# EAGLE design hw1_atmega328_veroboard (EAGLE 5.11)
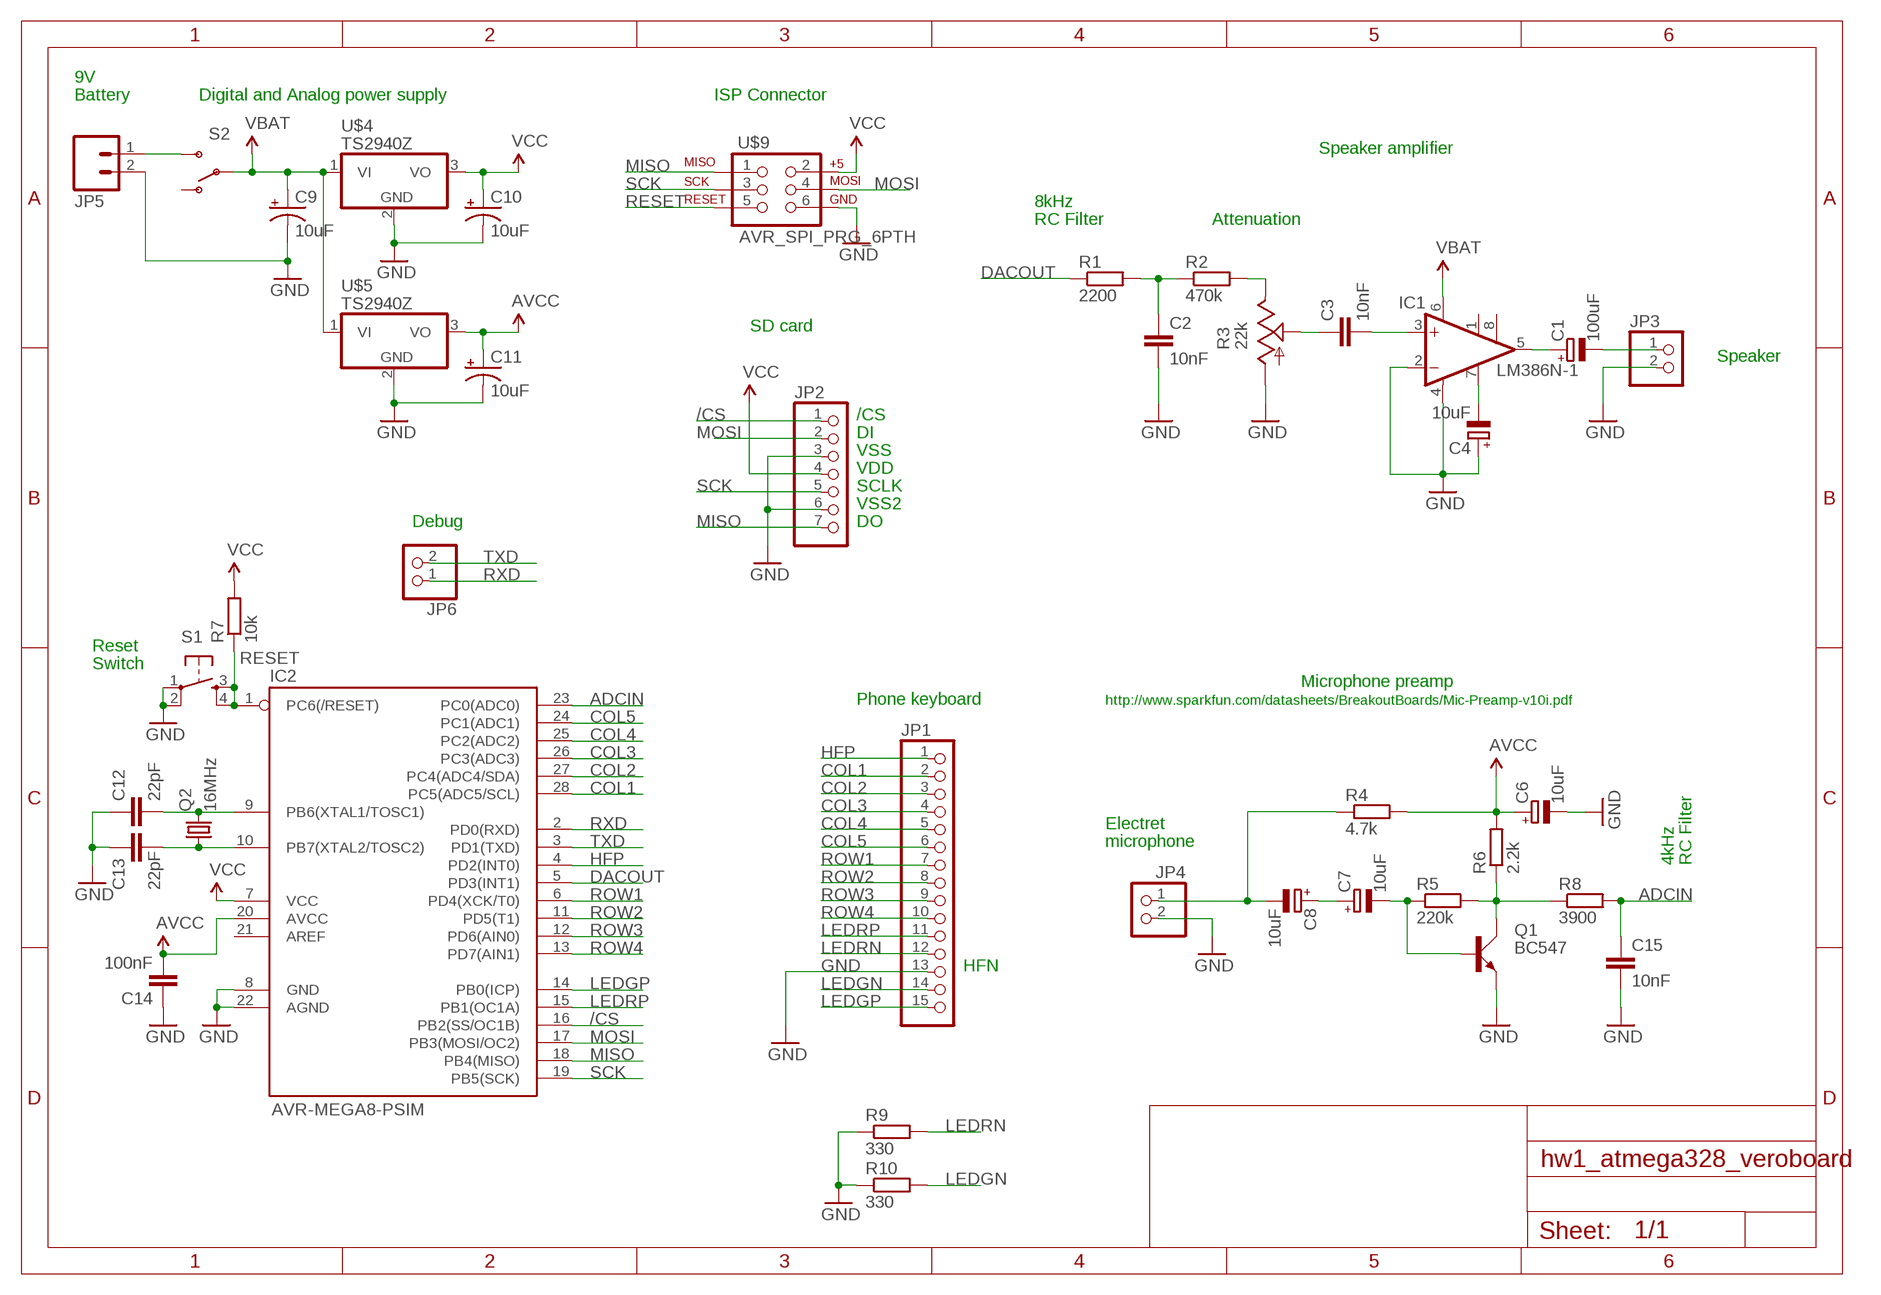
[diagram p0: schematic, sheet 1]

## Parts
C1  100uF  CPOL-EUE2-4  [E2-4]
C2  10nF  C-EU050-025X075  [C050-025X075]
C3  10nF  C-EU050-025X075  [C050-025X075]
C4  10uF  CPOL-EUE2-4  [E2-4]
C6  10uF  CPOL-EUE2,5-6E  [E2,5-6E]
C7  10uF  CPOL-EUE2,5-6E  [E2,5-6E]
C8  10uF  CPOL-EUE2,5-6E  [E2,5-6E]
C9  10uF  CPOL-USE2,5-6E  [E2,5-6E]
C10  10uF  CPOL-USE2,5-6E  [E2,5-6E]
C11  10uF  CPOL-USE2,5-6E  [E2,5-6E]
C12  22pF  C-EU025-025X050  [C025-025X050]
C13  22pF  C-EU025-025X050  [C025-025X050]
C14  100nF  C-EU025-025X050  [C025-025X050]
C15  10nF  C-EU025-024X044  [C025-024X044]
IC1  LM386N-1  [DIL08]
IC2  AVR-MEGA8-PSIM  [DIL28-3-SIMON]
JP1  PINHD-1X15  [1X15]
JP2  PINHD-1X7  [1X07]
JP3  PINHD-1X2  [1X02]
JP4  PINHD-1X2  [1X02]
JP5  M025MM  [SCREWTERMINAL-5MM-2]
JP6  PINHD-1X2  [1X02]
Q1  BC547  [SOT54A]
Q2  16MHz  CRYSTALHC49UV  [HC49U-V]
R1  2200  R-EU_0204/5  [0204/5]
R2  470k  R-EU_0204/5  [0204/5]
R3  22k  TRIM_US-CIP20C-6MM  [CIP20C-6MM]
R4  4.7k  R-EU_0204/5  [0204/5]
R5  220k  R-EU_0204/5  [0204/5]
R6  2.2k  R-EU_0204/5  [0204/5]
R7  10k  R-EU_0204/5  [0204/5]
R8  3900  R-EU_0204/5  [0204/5]
R9  330  R-EU_0204/5  [0204/5]
R10  330  R-EU_0204/5  [0204/5]
S1  TAC_SWITCHPTH  [TACTILE-PTH]
S2  SWITCH-SPSTPTH  [SWITCH-SPDT]
U$4  TS2940Z  [TO220H]
U$5  TS2940Z  [TO220H]
U$9  AVR_SPI_PRG_6PTH  [2X3]

## Nets
5V: C6.+ C14.2 IC1.6(VS) IC2.7(VCC) IC2.20(AVCC) JP2.4 R4.2 R6.2 R7.2 U$9.2 ; supply symbol labelled VCC, AVCC, VBAT
/CS: IC2.16(PB2(SS/OC1B)) JP2.1
ADCIN: C15.1 IC2.23(PC0(ADC0)) R8.2
AVCC: C11.+ U$5.3(VO)
COL1: IC2.28(PC5(ADC5/SCL)) JP1.2
COL2: IC2.27(PC4(ADC4/SDA)) JP1.3
COL3: IC2.26(PC3(ADC3)) JP1.4
COL4: IC2.25(PC2(ADC2)) JP1.5
COL5: IC2.24(PC1(ADC1)) JP1.6
DACOUT: IC2.5(PD3(INT1)) R1.1
GND: C2.2 C4.+ C6.- C9.- C10.- C11.- C12.1 C13.1 C14.1 C15.2 IC1.2(-IN) IC1.4(GND) IC2.8(GND) IC2.22(AGND) JP1.13 JP2.3 JP2.6 JP3.2 JP4.2 JP5.2 Q1.E R3.A R9.1 R10.1 S1.1 S1.2 U$4.2(GND) U$5.2(GND) U$9.6
HFP: IC2.4(PD2(INT0)) JP1.1
LEDGN: JP1.14 R10.2
LEDGP: IC2.14(PB0(ICP)) JP1.15
LEDRN: JP1.12 R9.2
LEDRP: IC2.15(PB1(OC1A)) JP1.11
MISO: IC2.18(PB4(MISO)) JP2.7 U$9.1
MOSI: IC2.17(PB3(MOSI/OC2)) JP2.2 U$9.4
N$1: C1.+ IC1.5(OUT)
N$2: C1.- JP3.1
N$3: C3.2 IC1.3(+IN)
N$4: C8.- JP4.1 R4.1
N$5: C4.- IC1.7(BYPASS)
N$6: C2.1 R1.2 R2.1
N$7: R2.2 R3.E
N$8: C7.+ C8.+
N$9: C7.- Q1.B R5.1
N$10: C3.1 R3.S
N$15: JP5.1 S2.3(S)
N$16: Q1.C R5.2 R6.1 R8.1
N$17: C12.2 IC2.9(PB6(XTAL1/TOSC1)) Q2.2
N$18: C13.2 IC2.10(PB7(XTAL2/TOSC2)) Q2.1
RESET: IC2.1(PC6(/RESET)) R7.1 S1.3 S1.4 U$9.5
ROW1: IC2.6(PD4(XCK/T0)) JP1.7
ROW2: IC2.11(PD5(T1)) JP1.8
ROW3: IC2.12(PD6(AIN0)) JP1.9
ROW4: IC2.13(PD7(AIN1)) JP1.10
RXD: IC2.2(PD0(RXD)) JP6.1
SCK: IC2.19(PB5(SCK)) JP2.5 U$9.3
TXD: IC2.3(PD1(TXD)) JP6.2
VBAT: C9.+ S2.2(P) U$4.1(VI) U$5.1(VI)
VCC: C10.+ U$4.3(VO)
Unconnected: IC1.1(GAIN) IC1.8(GAIN) IC2.21(AREF) S2.1(O)

## Notes on the sheet
- 9V
- Battery | Digital and Analog power supply | ISP Connector
- Speaker amplifier
- 8kHz
- RC Filter | Attenuation
- SD card
- Speaker
- /CS
- DI
- VSS
- VDD
- SCLK
- VSS2
- Debug | DO
- Reset
- Switch
- Microphone preamp
- Phone keyboard | http://www.sparkfun.com/datasheets/BreakoutBoards/Mic-Preamp-v10i.pdf
- Electret
- microphone
- 4kHz | RC Filter
- HFN

## Library data of the parts
C1 C4 C6-C8 = rcl:CPOL-EU: POLARIZED CAPACITOR, European symbol
C2 C3 C12-C15 = rcl:C-EU: CAPACITOR, European symbol
C9-C11 = rcl:CPOL-US: POLARIZED CAPACITOR, American symbol
IC1 = linear:LM386?-*: Low Voltage Audio Power Amplifier Source: http://cache.national.com/ds/LM/LM386.pdf
IC2 = sparkfun-20090728:AVR-MEGA8-P: MICROCONTROLLER 8 Kbytes FLASH 1 kbytes SRAM 512 bytes EEPROM USART 4-channel 10 bit ADC 2-channel 8 bit ADC
JP1 = pinhead:PINHD-1X15: PIN HEADER
JP2 = pinhead:PINHD-1X7: PIN HEADER
JP3 JP4 JP6 = pinhead:PINHD-1X2: PIN HEADER
JP5 = sparkfun-20090728:M02: Header 2 Standard 2-pin 0.1" header. Use with straight break away headers (SKU : PRT-00116), right angle break away headers (PRT-00553), swiss pins (PRT-00743), machine pins (PRT-00117), and female headers (PRT-00115). Molex polarized connector foot print use with SKU : PRT-08233 with associated crimp pins and housings.
Q1 = transistor-small-signal:BC547: NPN TRANSISTOR
Q2 = sparkfun-20090728:CRYSTAL: Crystals Various standard crystals. Proven footprints. Spark Fun Electronics SKU : COM-00534
R1 R2 R4-R10 = rcl:R-EU_: RESISTOR, European symbol
R3 = pot:TRIM_US-: POTENTIOMETER
S1 = sparkfun-20090728:TAC_SWITCH: Momentary Switch Button commonly used for reset or general input. Spark Fun Electronics SKU : COM-00097
S2 = sparkfun-20090728:SWITCH-SPST: SPST Switch Simple slide switch. Spark Fun Electronics SKU : COM-00102
U$4 U$5 = elasticsheep:TS2940
U$9 = sparkfun-20090728:AVR_SPI_PRG_6: AVR ISP 6 Pin This is the reduced ISP connector for AVR programming. Common on Arduino. This footprint will take up less PCB space and can be used with a 10-pin to 6-pin adapter such as SKU: BOB-08508

## Board
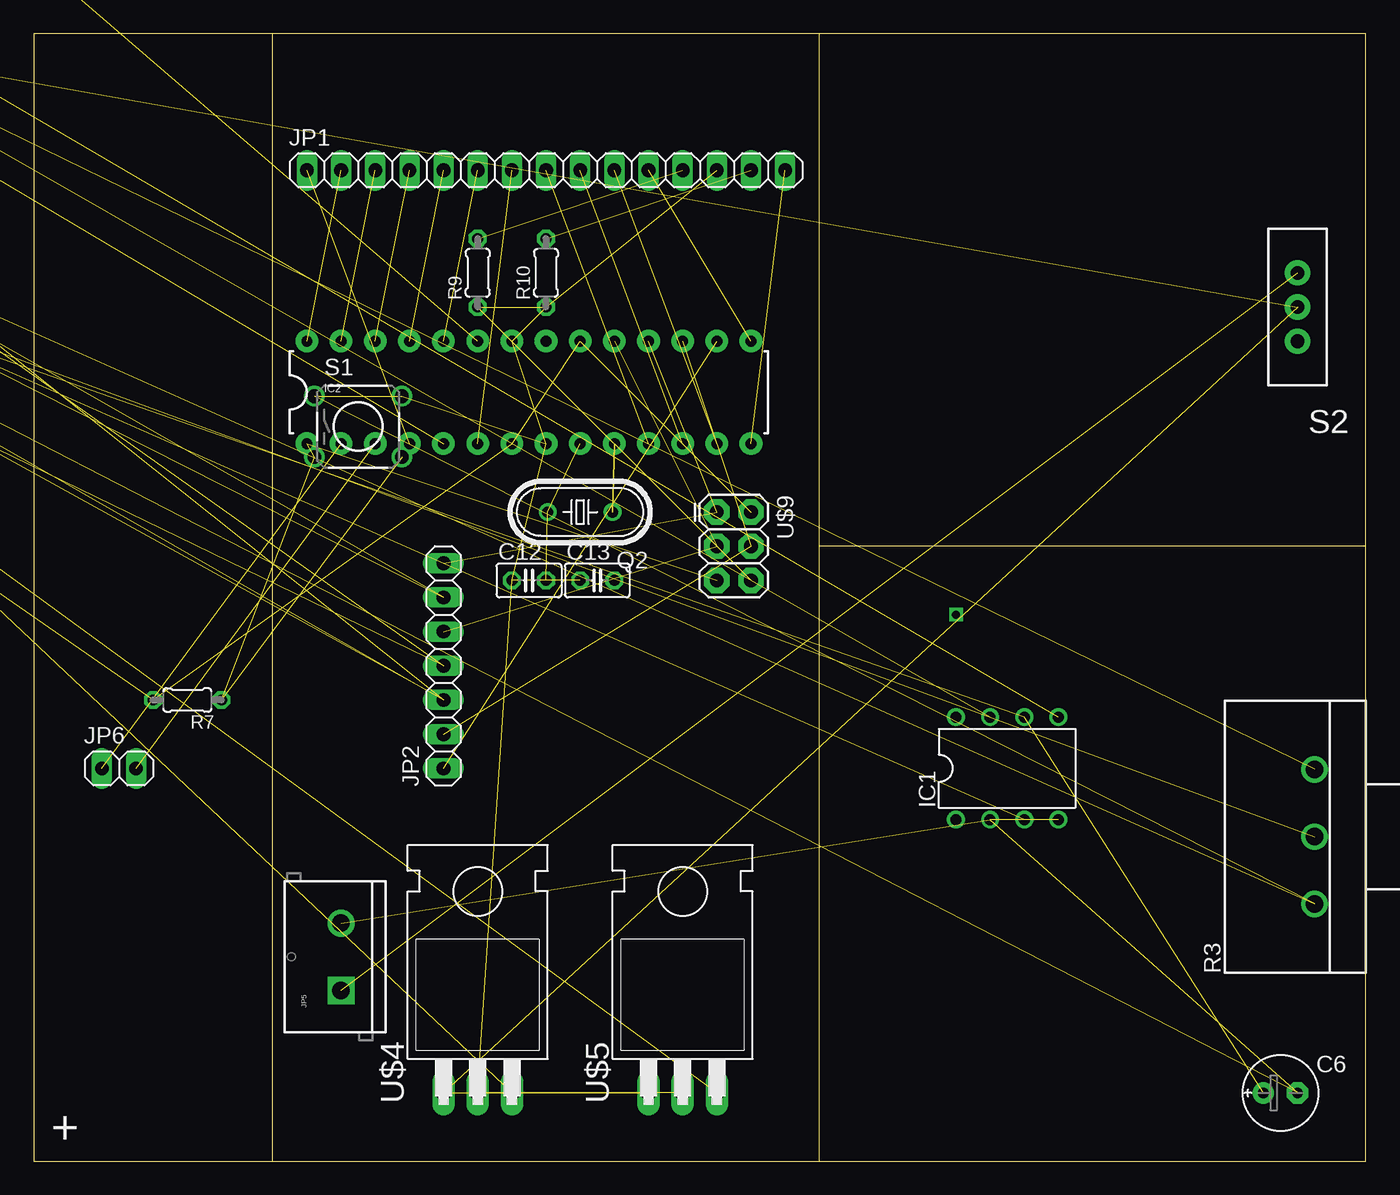
[diagram p1: board, top side]

Size 99.06 x 83.82 mm. Coordinates in mm from the lower left corner, seen from the top.
Outline: 17.78,0 0,0 0,83.82 17.78,83.82
Outline: 17.78,0 58.42,0
Outline: 58.42,0 99.06,0 99.06,45.72
Outline: 99.06,45.72 99.06,83.82 17.78,83.82
Outline: 58.42,0 58.42,45.72
Outline: 58.42,45.72 58.42,83.82
Outline: 99.06,45.72 58.42,45.72
Outline: 17.78,0 17.78,83.82
Copper layers (1*16): Top 0.035mm / dielectric 1.5mm / Bottom 0.035mm
Design rules "default": minimum track width 10mil, minimum drill 24mil, track to track 8mil, track to pad 8mil, pad to pad 8mil, via to via 8mil, smd to smd 8mil, copper to edge 40mil, drill to drill 8mil, minimum pad ring 10mil, minimum via ring 8mil, stop-mask expansion 4mil, vias tented up to drill 0mil, thermal gap 10mil

### Footprints (pad centres in the part's own frame; a part is rotated, then mirrored left to right if it is on the bottom)
E2-4 = drill 0.813 pad 1.27 round: + -1.016,0 | drill 0.813 pad 1.27 octagon: - 1.016,0
C050-025X075 = drill 0.813 octagon: 1 -2.54,0; 2 2.54,0
E2,5-6E = drill 0.813 pad 1.575 round: + -1.27,0 | drill 0.813 pad 1.575 octagon: - 1.27,0
C025-025X050 = drill 0.813 octagon: 1 -1.27,0; 2 1.27,0
C025-024X044 = drill 0.813 octagon: 1 -1.27,0; 2 1.27,0
DIL08 = drill 0.813 pad 1.27 round: 1 -3.81,-3.81; 2 -1.27,-3.81; 3 1.27,-3.81; 4 3.81,-3.81; 5 3.81,3.81; 6 1.27,3.81; 7 -1.27,3.81; 8 -3.81,3.81
DIL28-3-SIMON = drill 0.813 pad 1.676 round: 1 -16.51,-3.81; 2 -13.97,-3.81; 3 -11.43,-3.81; 4 -8.89,-3.81; 5 -6.35,-3.81; 6 -3.81,-3.81; 7 -1.27,-3.81; 8 1.27,-3.81; 9 3.81,-3.81; 10 6.35,-3.81; 11 8.89,-3.81; 12 11.43,-3.81; 13 13.97,-3.81; 14 16.51,-3.81; 15 16.51,3.81; 16 13.97,3.81; 17 11.43,3.81; 18 8.89,3.81; 19 6.35,3.81; 20 3.81,3.81; 21 1.27,3.81; 22 -1.27,3.81; 23 -3.81,3.81; 24 -6.35,3.81; 25 -8.89,3.81; 26 -11.43,3.81; 27 -13.97,3.81; 28 -16.51,3.81
1X15 = drill 1.016 long: 1 -17.78,0; 2 -15.24,0; 3 -12.7,0; 4 -10.16,0; 5 -7.62,0; 6 -5.08,0; 7 -2.54,0; 8 0,0; 9 2.54,0; 10 5.08,0; 11 7.62,0; 12 10.16,0; 13 12.7,0; 14 15.24,0; 15 17.78,0
1X07 = drill 1.016 long: 1 -7.62,0; 2 -5.08,0; 3 -2.54,0; 4 0,0; 5 2.54,0; 6 5.08,0; 7 7.62,0
1X02 = drill 1.016 long: 1 -1.27,0; 2 1.27,0
SCREWTERMINAL-5MM-2 = drill 1.3 pad 2.032 square: 1 0,0 | drill 1.3 pad 2.032 round: 2 5,0
SOT54A = drill 0.813 octagon: B 0,1.905; C -1.27,0; E 1.27,0
HC49U-V = drill 0.813 round: 1 -2.413,0; 2 2.413,0
0204/5 = drill 0.813 octagon: 1 -2.54,0; 2 2.54,0
CIP20C-6MM = drill 1.3 pad 1.93 round: A -5,0; E 5,0; S 0,0
TACTILE-PTH = drill 1.016 round: 1 -3.251,2.261; 2 3.251,2.261; 3 -3.251,-2.261; 4 3.251,-2.261
SWITCH-SPDT = drill 1.016 pad 1.88 round: 1 0,2.54; 2 0,0; 3 0,-2.54
TO220H = drill 1.118 long: 1 -2.54,-10.16; 2 0,-10.16; 3 2.54,-10.16
2X3 = drill 1.016 pad 1.88 octagon: 1 0,0; 2 0,2.54; 3 2.54,0; 4 2.54,2.54; 5 5.08,0; 6 5.08,2.54

### Placement (x,y rotation side)
C1  -50.8,107.95 0 top  (outside the outline)
C2  -38.1,77.47 0 top  (outside the outline)
C3  -46.99,77.47 0 top  (outside the outline)
C4  -60.96,107.95 0 top  (outside the outline)
C6  92.71,5.08 0 top
C7  -20.32,87.63 0 top  (outside the outline)
C8  -30.48,87.63 0 top  (outside the outline)
C9  -40.64,87.63 0 top  (outside the outline)
C10  -50.8,87.63 0 top  (outside the outline)
C11  -60.96,87.63 0 top  (outside the outline)
C12  36.83,43.18 0 top
C13  41.91,43.18 0 top
C14  -54.61,77.47 0 top  (outside the outline)
C15  -67.31,87.63 0 top  (outside the outline)
IC1  72.39,29.21 0 top
IC2  36.83,57.15 0 top
JP1  38.1,73.66 0 top
JP2  30.48,36.83 90 top
JP3  -74.93,93.98 0 top  (outside the outline)
JP4  -16.51,100.33 0 top  (outside the outline)
JP5  22.86,12.7 90 top
JP6  6.35,29.21 0 top
Q1  -41.91,100.33 0 top  (outside the outline)
Q2  40.64,48.26 180 top
R1  -48.26,101.6 0 top  (outside the outline)
R2  -55.88,101.6 0 top  (outside the outline)
R3  95.25,24.13 90 top
R4  -63.5,101.6 0 top  (outside the outline)
R5  -71.12,101.6 0 top  (outside the outline)
R6  -78.74,101.6 0 top  (outside the outline)
R7  11.43,34.29 180 top
R8  -24.13,107.95 0 top  (outside the outline)
R9  33.02,66.04 90 top
R10  38.1,66.04 90 top
S1  24.13,54.61 0 top
S2  93.98,63.5 180 top
U$4  33.02,15.24 0 top
U$5  48.26,15.24 0 top
U$9  50.8,48.26 270 top

### Tracks (layer width: path | path; a pad name or v marks a point on that pad's centre or on a via)
5V  (9 unrouted)
/CS  (1 unrouted)
ADCIN  (2 unrouted)
AVCC  (1 unrouted)
COL1  (1 unrouted)
COL2  (1 unrouted)
COL3  (1 unrouted)
COL4  (1 unrouted)
COL5  (1 unrouted)
DACOUT  (1 unrouted)
GND  (28 unrouted)
HFP  (1 unrouted)
LEDGN  (1 unrouted)
LEDGP  (1 unrouted)
LEDRN  (1 unrouted)
LEDRP  (1 unrouted)
MISO  (2 unrouted)
MOSI  (2 unrouted)
N$1  (1 unrouted)
N$2  (1 unrouted)
N$3  (1 unrouted)
N$4  (2 unrouted)
N$5  (1 unrouted)
N$6  (2 unrouted)
N$7  (1 unrouted)
N$8  (1 unrouted)
N$9  (2 unrouted)
N$10  (1 unrouted)
N$11  (via drill 0.6)
  other vias: 68.58,40.64
N$15  (1 unrouted)
N$16  (3 unrouted)
N$17  (2 unrouted)
N$18  (2 unrouted)
RESET  (4 unrouted)
ROW1  (1 unrouted)
ROW2  (1 unrouted)
ROW3  (1 unrouted)
ROW4  (1 unrouted)
RXD  (1 unrouted)
SCK  (2 unrouted)
TXD  (1 unrouted)
VBAT  (3 unrouted)
VCC  (1 unrouted)

### Text on the board
tPlace: +